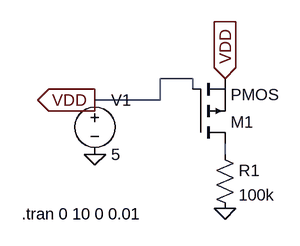
[diagram p0: schematic Draft5.asc]
Draft5.asc, the LTspice schematic file:
Version 4
SHEET 1 880 680
WIRE 144 48 96 48
WIRE 144 64 144 48
WIRE 96 80 96 48
WIRE 96 80 0 80
WIRE 192 160 192 144
FLAG 192 240 0
FLAG 0 80 VDD
IOPIN 0 80 Out
FLAG 192 48 VDD
IOPIN 192 48 In
FLAG 0 160 0
SYMBOL pmos 144 144 M180
SYMATTR InstName M1
SYMBOL res 176 144 R0
SYMATTR InstName R1
SYMATTR Value 100k
SYMBOL voltage 0 64 R0
WINDOW 123 0 0 Left 0
WINDOW 39 0 0 Left 0
SYMATTR InstName V1
SYMATTR Value 5
TEXT -108 248 Left 2 !.tran 0 10 0 0.01

The netlist it stands for:
* Draft5.asc
M1 N001 VDD VDD VDD PMOS
R1 N001 0 100k
V1 VDD 0 5
.model NMOS NMOS
.model PMOS PMOS
.lib standard.mos
.tran 0 10 0 0.01
.backanno
.end